# EAGLE design WEATHER INDICATOR (EAGLE 9.6.1)
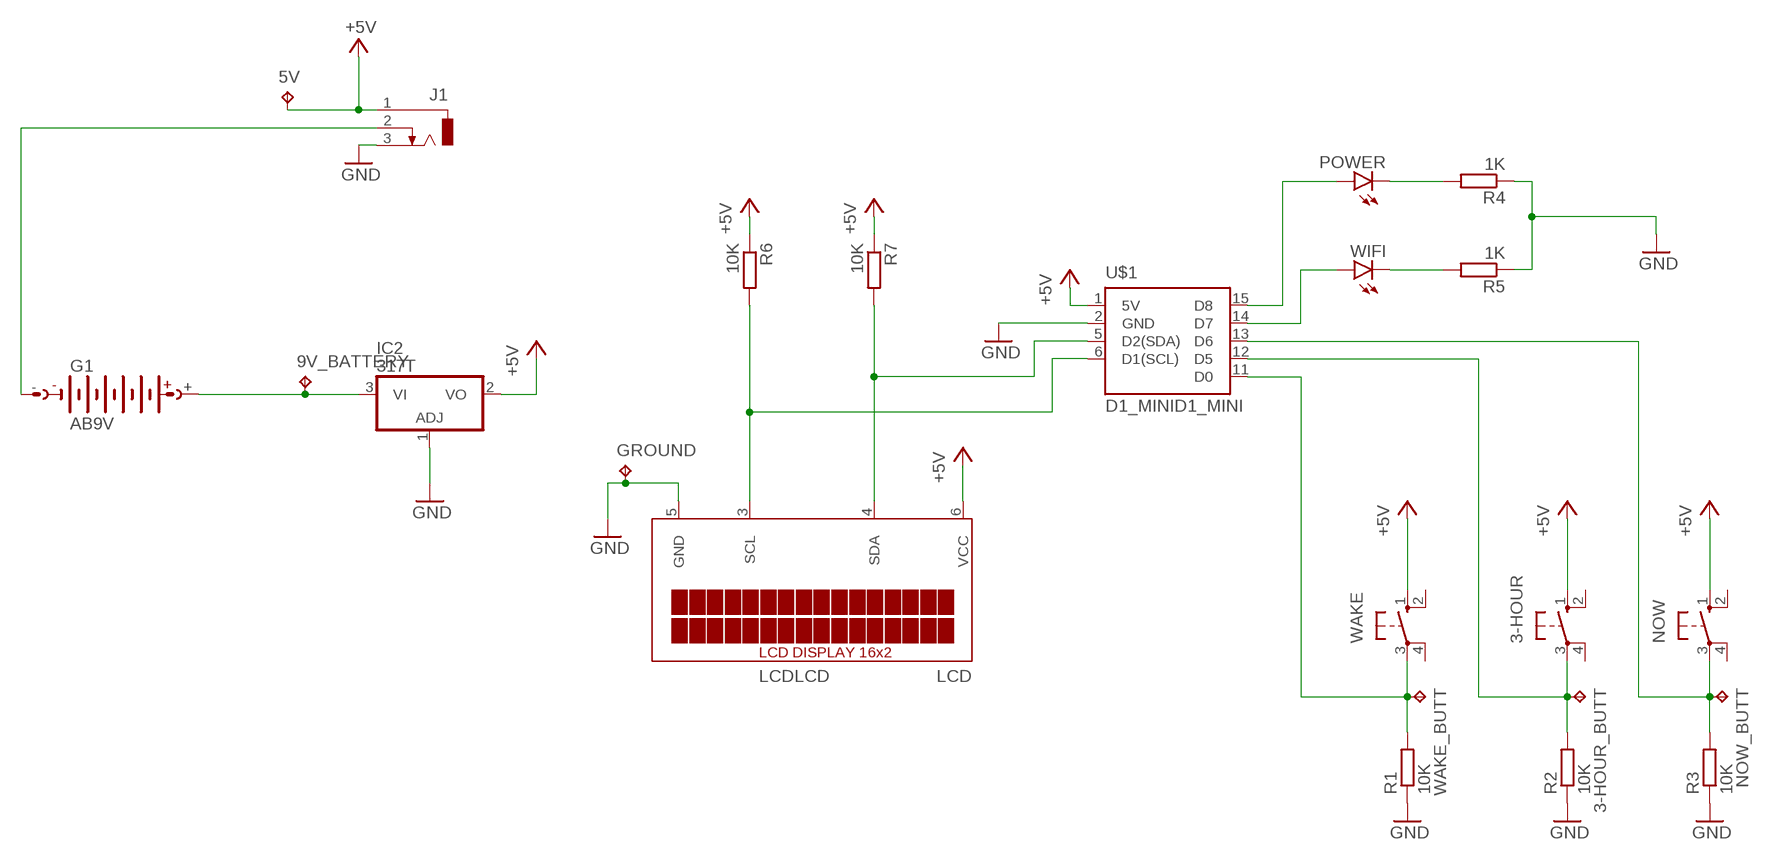
[diagram p0: schematic, sheet 1]

## Parts
3-HOUR  10-XX  [B3F-10XX]
3-HOUR_BUTT  TPB1,27  [B1,27]
5V  TPB1,27  [B1,27]
9V_BATTERY  TPB1,27  [B1,27]
G1  AB9V  [AB9V]
GROUND  TPB1,27  [B1,27]
IC2  317T  [TO220H]
J1  DCJ0303  [DCJ0303]
LCD  LCDLCD  [HDRV6W64P254_1X6_1016X508X838B]
NOW  10-XX  [B3F-10XX]
NOW_BUTT  TPB1,27  [B1,27]
POWER  LED3MM  [LED3MM]
R1  10K  R-EU_0204/7  [0204/7]
R2  10K  R-EU_0204/7  [0204/7]
R3  10K  R-EU_0204/7  [0204/7]
R4  1K  R-EU_0204/7  [0204/7]
R5  1K  R-EU_0204/7  [0204/7]
R6  10K  R-EU_0204/7  [0204/7]
R7  10K  R-EU_0204/7  [0204/7]
U$1  D1_MINID1_MINI  [DIP2540W53P254L3556H508Q16B]
WAKE  10-XX  [B3F-10XX]
WAKE_BUTT  TPB1,27  [B1,27]
WIFI  LED3MM  [LED3MM]

## Nets
+5V: 3-HOUR.1(S) 5V.TP IC2.2(VO) J1.1 LCD.6(VCC) NOW.1(S) R6.1 R7.1 U$1.1(5V) WAKE.1(S)
GND: GROUND.TP IC2.1(ADJ) J1.3 LCD.5(GND) R1.1 R2.1 R3.1 R4.1 R5.1 U$1.2(GND)
N$1: LCD.4(SDA) R7.2 U$1.5(D2(SDA))
N$2: 9V_BATTERY.TP G1.+ IC2.3(VI)
N$3: G1.- J1.2
N$4: LCD.3(SCL) R6.2 U$1.6(D1(SCL))
N$6: 3-HOUR.3(P) 3-HOUR_BUTT.TP R2.2 U$1.12(D5)
N$7: NOW.3(P) NOW_BUTT.TP R3.2 U$1.13(D6)
N$8: POWER.K(C) R4.2
N$9: R5.2 WIFI.K(C)
N$10: POWER.A U$1.15(D8)
N$11: U$1.14(D7) WIFI.A
N$13: R1.2 U$1.11(D0) WAKE.3(P) WAKE_BUTT.TP
Unconnected: 3-HOUR.2(S1) 3-HOUR.4(P1) NOW.2(S1) NOW.4(P1) WAKE.2(S1) WAKE.4(P1)

## Library data of the parts
3-HOUR NOW WAKE = switch-omron:10-XX: OMRON SWITCH; MPN: B3F-1000; OC_FARNELL: 176432; OC_NEWARK: 36M3542
3-HOUR_BUTT 5V 9V_BATTERY GROUND NOW_BUTT WAKE_BUTT = testpad:TP: Test pad
G1 = battery:AB9V: 9-V BATTERY CLIP
IC2 = linear:*317: Positive VOLTAGE REGULATOR
J1 = con-jack:DCJ0303: DC POWER JACK Source: DCJ0303.pdf; OC_FARNELL: unknown; OC_NEWARK: unknown
LCD = WEATHER INDICATOR:LCD
POWER WIFI = led:LED: LED OSRAM: - CHIPLED LG R971, LG N971, LY N971, LG Q971, LY Q971, LO R971, LY R971 LH N974, LH R974 LS Q976, LO Q976, LY Q976 LO Q996 - Hyper CHIPLED LW Q18S LB Q993, LB Q99A, LB R99A - SideLED LS A670, LO A670, LY A670, LG A670, LP A670 LB A673, LV A673, LT A673, LW A673 LH A674 LY A675 LS A676, LA A676, LO A676, LY A676, LW A676 LS A679, LY A679, LG A679 - Hyper Micro SIDELED® LS Y876, LA Y876, LO Y876, LY Y876 LT Y87S - SmartLED LW L88C, LW L88S LB L89C, LB L89S, LG L890 LS L89K, LO L89K, LY L89K LS L896, LA L896, LO L896, LY L896 - TOPLED LS T670, LO T670, LY T670, LG T670, LP T670 LSG T670, LSP T670, LSY T670, LOP T670, LYG T670 LG T671, LOG T671, LSG T671 LB T673, LV T673, LT T673, LW T673 LH T674 LS T676, LA T676, LO T676, LY T676, LB T676, LH T676, LSB T676, LW T676 LB T67C, LV T67C, LT T67C, LS T67K, LO T67K, LY T67K, LW E67C LS E67B, LA E67B, LO E67B, LY E67B, LB E67C, LV E67C, LT E67C LW T67C LS T679, LY T679, LG T679 LS T770, LO T770, LY T770, LG T770, LP T770 LB T773, LV T773, LT T773, LW T773 LH T774 LS E675, LA E675, LY E675, LS T675 LS T776, LA T776, LO T776, LY T776, LB T776 LHGB T686 LT T68C, LB T68C - Hyper Mini TOPLED® LB M676 - Mini TOPLED Santana® LG M470 LS M47K, LO M47K, LY M47K Source: http://www.osram.convergy.de LUXEON: - LUMILED® LXK2-PW12-R00, LXK2-PW12-S00, LXK2-PW14-U00, LXK2-PW14-V00 LXK2-PM12-R00, LXK2-PM12-S00, LXK2-PM14-U00 LXK2-PE12-Q00, LXK2-PE12-R00, LXK2-PE12-S00, LXK2-PE14-T00, LXK2-PE14-U00 LXK2-PB12-K00, LXK2-PB12-L00, LXK2-PB12-M00, LXK2-PB14-N00, LXK2-PB14-P00, LXK2-PB14-Q00 LXK2-PR12-L00, LXK2-PR12-M00, LXK2-PR14-Q00, LXK2-PR14-R00 LXK2-PD12-Q00, LXK2-PD12-R00, LXK2-PD12-S00 LXK2-PH12-R00, LXK2-PH12-S00 LXK2-PL12-P00, LXK2-PL12-Q00, LXK2-PL12-R00 Source: www.luxeon.com KINGBRIGHT: KA-3528ASYC Source: www.kingbright.com
R1-R7 = rcl:R-EU_: RESISTOR, European symbol; SPICEPREFIX: R
U$1 = WEATHER INDICATOR:D1_MINI

## Board
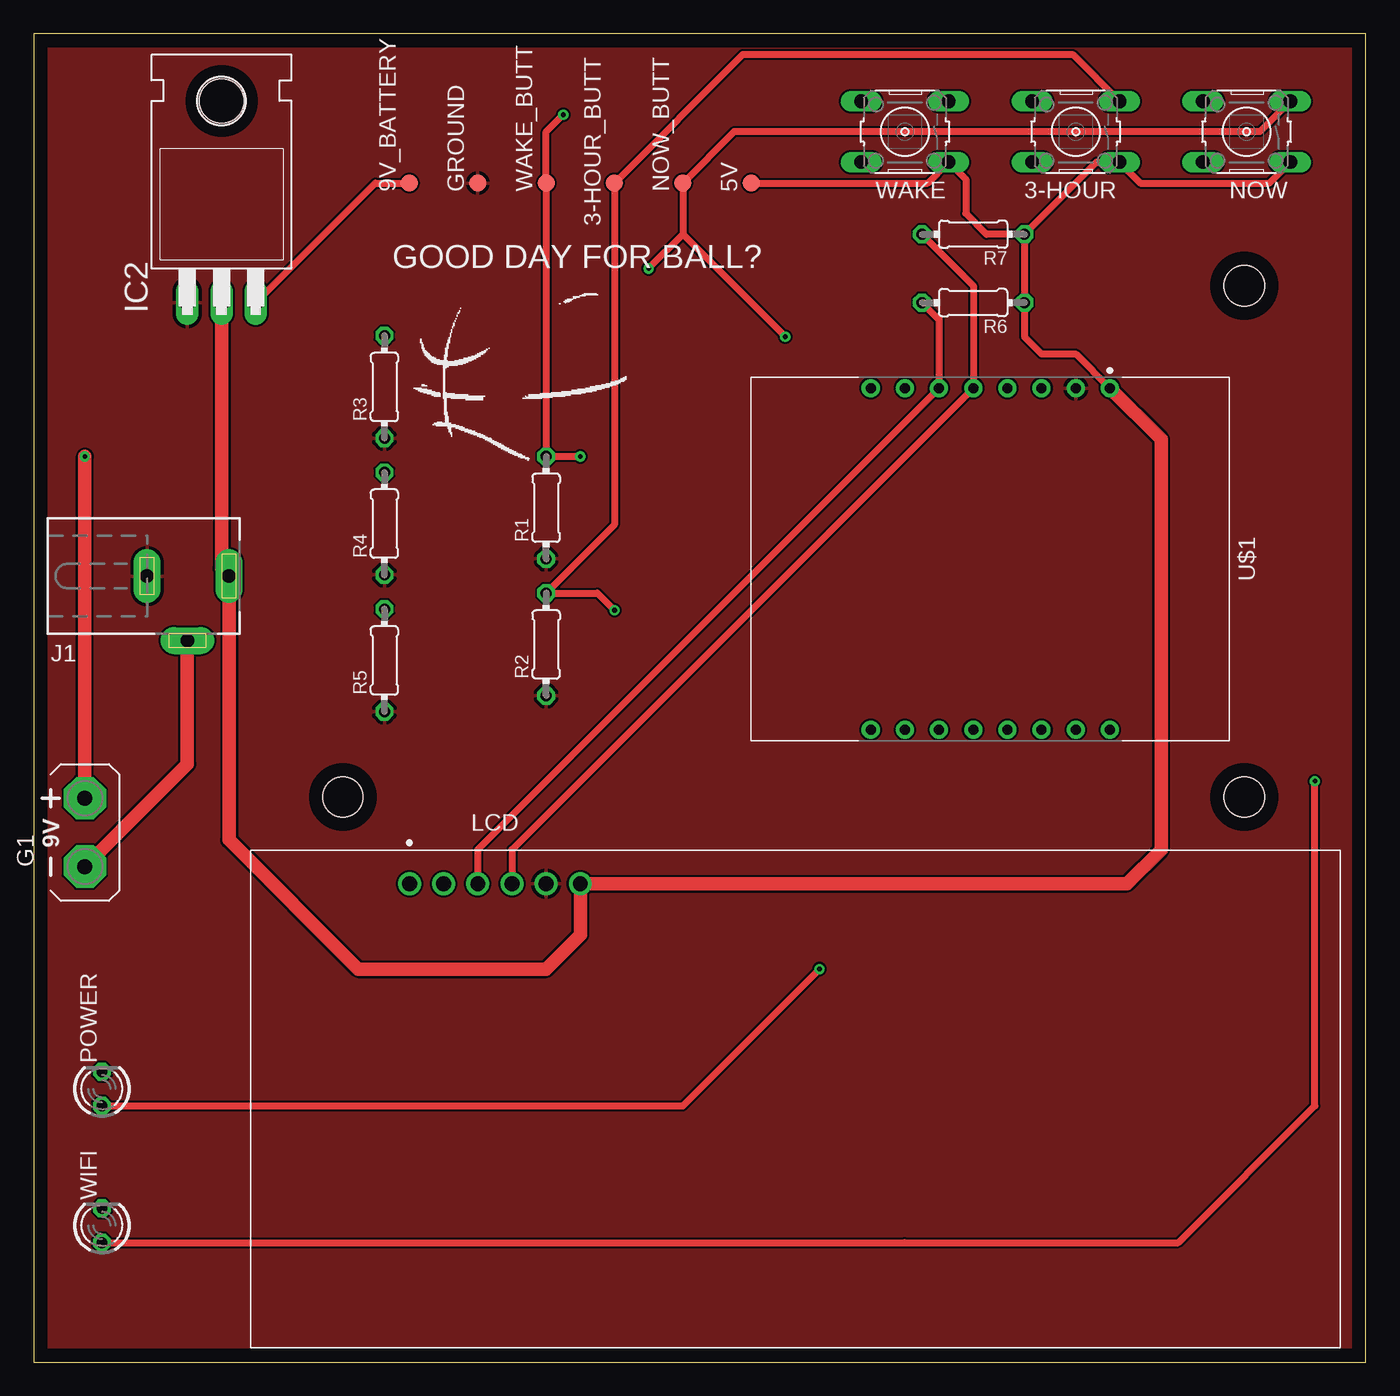
[diagram p1: board, top side]
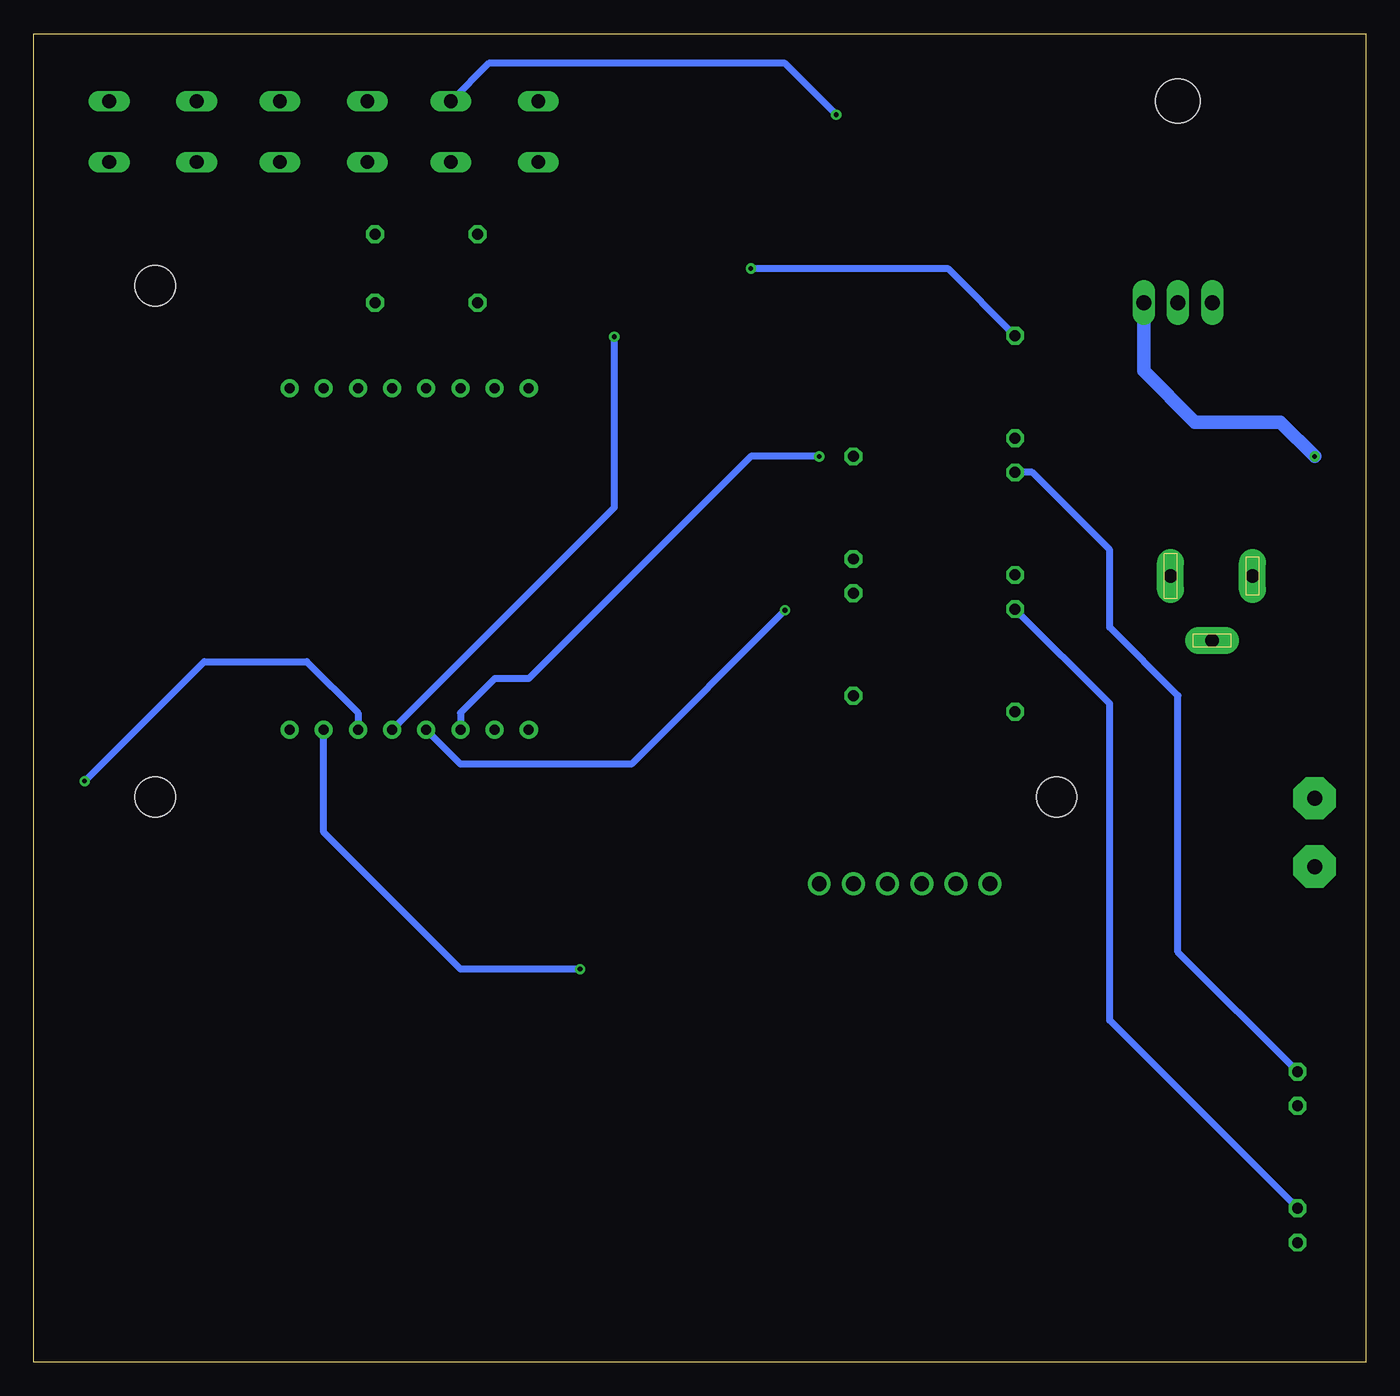
[diagram p2: board, bottom side, seen from below]

Size 99.04 x 98.73 mm. Coordinates in mm from the lower left corner, seen from the top.
Outline: 0,0 99.04,0 99.04,98.73 0,98.73 0,0
Copper layers (1*16): Top 0.035mm / dielectric 1.5mm / Bottom 0.035mm
Design rules "default": minimum track width 6mil, minimum drill 0.35mm, track to track 6mil, track to pad 6mil, pad to pad 6mil, via to via 6mil, smd to smd 6mil, copper to edge 40mil, drill to drill 6mil, minimum pad ring 10mil, minimum via ring 8mil, stop-mask expansion 4mil, vias tented up to drill 0mil, thermal gap 10mil
Holes 3 mm at 90,80 90,42 23,42

### Footprints (pad centres in the part's own frame; a part is rotated, then mirrored left to right if it is on the bottom)
B3F-10XX = drill 1.016 long: 1 -3.251,2.261; 2 3.251,2.261; 3 -3.251,-2.261; 4 3.251,-2.261
B1,27 = smd 1.27 x 1.27: TP 0,0
AB9V = drill 1.118 pad 3.15 octagon: + 0,2.54; - 0,-2.54
TO220H = drill 1.118 long: 1 -2.54,-10.16; 2 0,-10.16; 3 2.54,-10.16 | hole 3.302: 0,4.826
DCJ0303 = drill 1 pad 2 long: 1 0,3.1; 2 4.8,0; 3 0,-3
HDRV6W64P254_1X6_1016X508X838B = drill 1.105 pad 1.705: 1 -6.35,0; 2 -3.81,0; 3 -1.27,0; 4 1.27,0; 5 3.81,0; 6 6.35,0
LED3MM = drill 0.813 octagon: A -1.27,0; K 1.27,0
0204/7 = drill 0.813 octagon: 1 -3.81,0; 2 3.81,0
DIP2540W53P254L3556H508Q16B = drill 0.743 pad 1.343: 1 -12.7,8.89; 2 -12.7,6.35; 3 -12.7,3.81; 4 -12.7,1.27; 5 -12.7,-1.27; 6 -12.7,-3.81; 7 -12.7,-6.35; 8 -12.7,-8.89; 9 12.7,-8.89; 10 12.7,-6.35; 11 12.7,-3.81; 12 12.7,-1.27; 13 12.7,1.27; 14 12.7,3.81; 15 12.7,6.35; 16 12.7,8.89

### Placement (x,y rotation side)
3-HOUR  77.47,91.44 180 top
3-HOUR_BUTT  43.18,87.63 90 top
5V  53.34,87.63 90 top
9V_BATTERY  27.94,87.63 90 top
G1  3.81,39.37 0 top
GROUND  33.02,87.63 90 top
IC2  13.97,88.9 0 top
J1  11.43,58.42 270 top
LCD  34.29,35.56 0 top
NOW  90.17,91.44 180 top
NOW_BUTT  48.26,87.63 90 top
POWER  5.08,20.32 90 top
R1  38.1,63.5 90 top
R2  38.1,53.34 90 top
R3  26.08,72.47 90 top
R4  26.08,62.31 90 top
R5  26.08,52.15 90 top
R6  69.85,78.74 180 top
R7  69.85,83.82 180 top
U$1  71.12,59.69 270 top
WAKE  64.77,91.44 180 top
WAKE_BUTT  38.1,87.63 90 top
WIFI  5.08,10.16 90 top

### Tracks (layer width: path | path; a pad name or v marks a point on that pad's centre or on a via)
+5V
  Top 0.508: R7.1 R6.1 73.66,76.2 74.93,74.93 77.47,74.93 U$1.1 | R7.1 79.02,89.18 3-HOUR.1 82.27,87.63 91.87,87.63 NOW.1 | R7.1 70.84,83.82 69.29,85.37 69.29,87.91 WAKE.1 66.47,87.63 5V.TP
  Top 1.016: IC2.2 13.97,58.98 J1.1 14.53,38.81 24.13,29.21 38.1,29.21 40.64,31.75 LCD.6 81.28,35.56 83.82,38.1 83.82,68.58 U$1.1
GND
  pour Top: -1.27,99.06 -1.27,0 1.27,-2.54 97.79,-2.54 102.87,2.54 102.87,95.25 96.52,101.6 1.27,101.6
N$1
  Top 0.508: R7.2 69.85,80.01 U$1.5 35.56,38.1 LCD.4
N$2  (via drill 0.35)
  Top 0.508: IC2.3 25.4,87.63 9V_BATTERY.TP
  Top 1.016: G1.+ v3.81,67.31
  Bottom 1.016: v3.81,67.31 6.35,69.85 12.7,69.85 16.51,73.66 IC2.3
N$3
  Top 1.016: G1.- 11.43,44.45 J1.2
N$4
  Top 0.508: R6.2 67.31,77.47 U$1.6 33.02,38.1 LCD.3
N$6  (via drill 0.35)
  Top 0.508: 3-HOUR.3 77.24,97.18 52.73,97.18 3-HOUR_BUTT.TP 43.18,62.23 R2.2 41.91,57.15 v43.18,55.88
  Bottom 0.508: v43.18,55.88 54.61,44.45 67.31,44.45 U$1.12
N$7  (via drill 0.35)
  Top 0.508: NOW.3 91.16,91.44 52.07,91.44 NOW_BUTT.TP 48.26,83.82 | 48.26,83.82 v55.88,76.2 | 48.26,83.82 v45.72,81.28
  Bottom 0.508: v55.88,76.2 55.88,63.5 U$1.13 | R3.2 31.07,81.28 v45.72,81.28
N$8
  Bottom 0.508: POWER.K 13.97,30.48 13.97,49.53 19.05,54.61 19.05,60.37 24.81,66.12 R4.2
N$9
  Bottom 0.508: WIFI.K 19.05,25.4 19.05,48.94 R5.2
N$10  (via drill 0.35)
  Top 0.508: POWER.A 48.26,19.05 v58.42,29.21
  Bottom 0.508: v58.42,29.21 67.31,29.21 77.47,39.37 U$1.15
N$11  (via drill 0.35)
  Top 0.508: WIFI.A 64.77,8.89 85.09,8.89 95.25,19.05 v95.25,43.18
  Bottom 0.508: v95.25,43.18 86.36,52.07 78.74,52.07 74.93,48.26 U$1.14
N$13  (via drill 0.35)
  Top 0.508: v39.37,92.71 38.1,91.44 WAKE_BUTT.TP R1.2 v40.64,67.31
  Bottom 0.508: v39.37,92.71 43.18,96.52 65.2,96.52 WAKE.3 | v40.64,67.31 45.72,67.31 62.23,50.8 64.77,50.8 67.31,48.26 U$1.11

### Text on the board
tPlace: GOOD DAY FOR BALL?